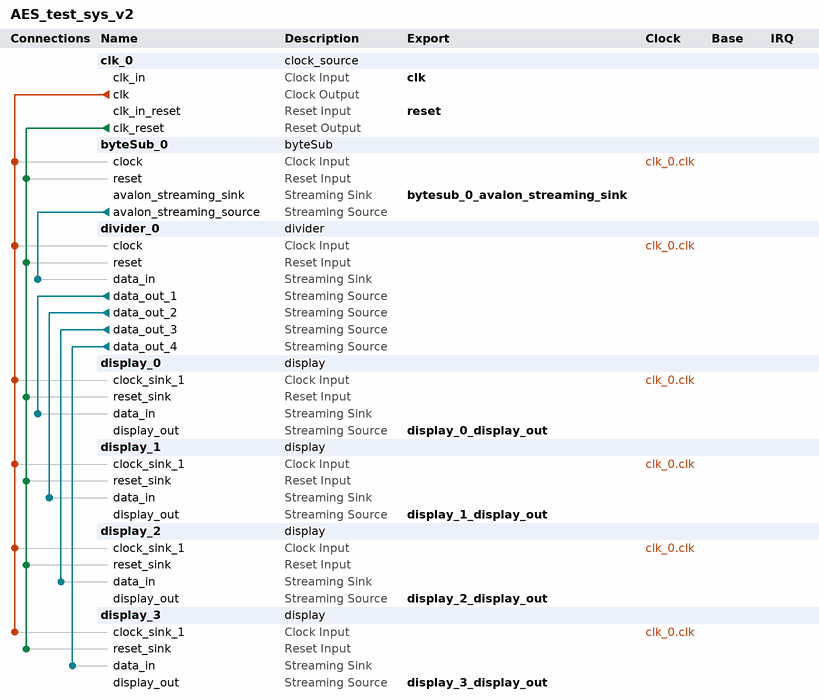
[diagram p0: system contents]
# Platform Designer (Qsys) system AES_test_sys_v2, MAX 10 10M50DAF484C7G
# Parameters at their usual value, and those the tool derives, are not listed.
package require -exact qsys 18.0
create_system AES_test_sys_v2
set_project_property DEVICE_FAMILY {MAX 10}
set_project_property DEVICE 10M50DAF484C7G

add_instance clk_0 clock_source 18.0
set_instance_parameter_value clk_0 clockFrequency 50000000

add_instance byteSub_0 byteSub 1.0

add_instance divider_0 divider 1.0

add_instance display_0 display 1.0

add_instance display_1 display 1.0

add_instance display_2 display 1.0

add_instance display_3 display 1.0

# connections
add_connection clk_0.clk byteSub_0.clock clock
add_connection clk_0.clk display_0.clock_sink_1 clock
add_connection clk_0.clk display_1.clock_sink_1 clock
add_connection clk_0.clk display_2.clock_sink_1 clock
add_connection clk_0.clk display_3.clock_sink_1 clock
add_connection clk_0.clk divider_0.clock clock
add_connection clk_0.clk_reset byteSub_0.reset reset
add_connection clk_0.clk_reset display_0.reset_sink reset
add_connection clk_0.clk_reset display_1.reset_sink reset
add_connection clk_0.clk_reset display_2.reset_sink reset
add_connection clk_0.clk_reset display_3.reset_sink reset
add_connection clk_0.clk_reset divider_0.reset reset
add_connection byteSub_0.avalon_streaming_source divider_0.data_in avalon_streaming
add_connection divider_0.data_out_1 display_0.data_in avalon_streaming
add_connection divider_0.data_out_2 display_1.data_in avalon_streaming
add_connection divider_0.data_out_3 display_2.data_in avalon_streaming
add_connection divider_0.data_out_4 display_3.data_in avalon_streaming

# exported interfaces
add_interface bytesub_0_avalon_streaming_sink avalon_streaming sink
set_interface_property bytesub_0_avalon_streaming_sink EXPORT_OF byteSub_0.avalon_streaming_sink
add_interface clk clock sink
set_interface_property clk EXPORT_OF clk_0.clk_in
add_interface display_0_display_out avalon_streaming source
set_interface_property display_0_display_out EXPORT_OF display_0.display_out
add_interface display_1_display_out avalon_streaming source
set_interface_property display_1_display_out EXPORT_OF display_1.display_out
add_interface display_2_display_out avalon_streaming source
set_interface_property display_2_display_out EXPORT_OF display_2.display_out
add_interface display_3_display_out avalon_streaming source
set_interface_property display_3_display_out EXPORT_OF display_3.display_out
add_interface reset reset sink
set_interface_property reset EXPORT_OF clk_0.clk_in_reset

set_interconnect_requirement {$system} qsys_mm.clockCrossingAdapter HANDSHAKE
set_interconnect_requirement {$system} qsys_mm.enableEccProtection FALSE
set_interconnect_requirement {$system} qsys_mm.insertDefaultSlave FALSE
set_interconnect_requirement {$system} qsys_mm.maxAdditionalLatency 1

save_system AES_test_sys_v2.qsys
